# Altium schematic sheet Indication.SchDoc
size 420 x 297 mm; Address1: Address1; Address2: Address2; Address3: Address3; Address4: Address4; DocumentNumber: *Э3; SheetNumber: 7; SheetTotal: 11; DocumentType: Схема электрическая *
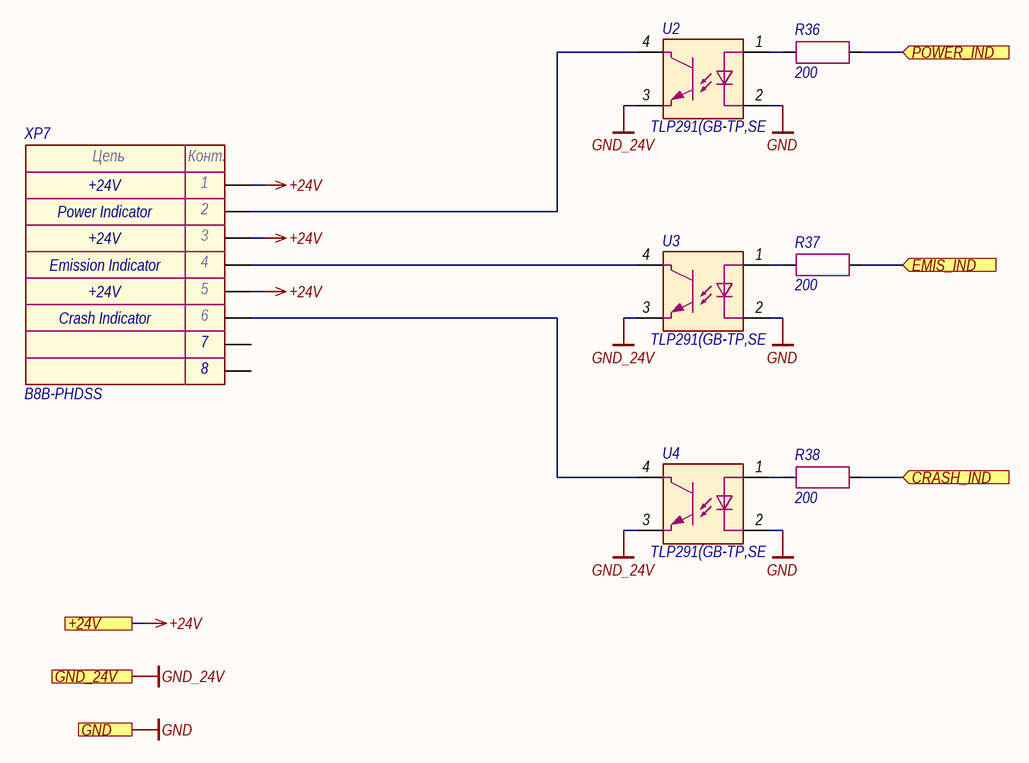
[diagram p0: Indication.SchDoc]

## Parts
R36  200  [RES_0603]
R37  200  [RES_0603]
R38  200  [RES_0603]
U2  TLP291(GB-TP,SE  [11-3C1]
U3  TLP291(GB-TP,SE  [11-3C1]
U4  TLP291(GB-TP,SE  [11-3C1]
XP7  B8B-PHDSS  [B8B-PHDSS]

## Ports
+24V (see Main[2A], Hardwiring[3C], LD_driver[1D], Power_supply[2C]), CRASH_IND (in, see Main[2A]), EMIS_IND (in, see Main[2A]), GND (see Main[2A], Ethernet[3D], Fiber_interlock[2C], Guide_laser[1C], Hardwiring[3D], LD_driver[1D], Power_supply[2D], Protection[2C]), GND_24V (see Main[2A], Hardwiring[3C], LD_driver[1D], Power_supply[2C]), POWER_IND (in, see Main[2A])

## Nets
+24V: XP7.1 XP7.3 XP7.5 ; port +24V
GND: U2.2 U3.2 U4.2 ; port GND
GND_24V: U2.3 U3.3 U4.3 ; port GND_24V
CRASH_IND: R38.2 ; port CRASH_IND
EMIS_IND: R37.2 ; port EMIS_IND
POWER_IND: R36.2 ; port POWER_IND
NetR36_1: R36.1 U2.1
NetR37_1: R37.1 U3.1
NetR38_1: R38.1 U4.1
NetU2_4: U2.4 XP7.2
NetU3_4: U3.4 XP7.4
NetU4_4: U4.4 XP7.6

Not connected (* = marked no-connect by the designer): XP7 7 8

## Notes on the sheet
- Power Indicator
- +24V
- (near XP7) Emission Indicator
- Crash Indicator
- Подп. и дата
- Инв. № дубл.
- Взам. инв. №
- Инв. № подл.
- Изм.
- Лист
- № докум.
- Подп.
- Дата
- Копировал
- Формат А3
- (in symbol Connector-8) Цепь; Конт.

## Library data of the parts
R36-R38 = Resistor: Manufacturer: Yageo; Model: RC0603FR-07200RL; Value: 200; Document: *
U2-U4 = TLP291: Manufacturer: Toshiba; Model: TLP291(GB-TP,SE; Document: *
XP7 = Connector-8: Manufacturer: JST; Model: B8B-PHDSS; Document: *